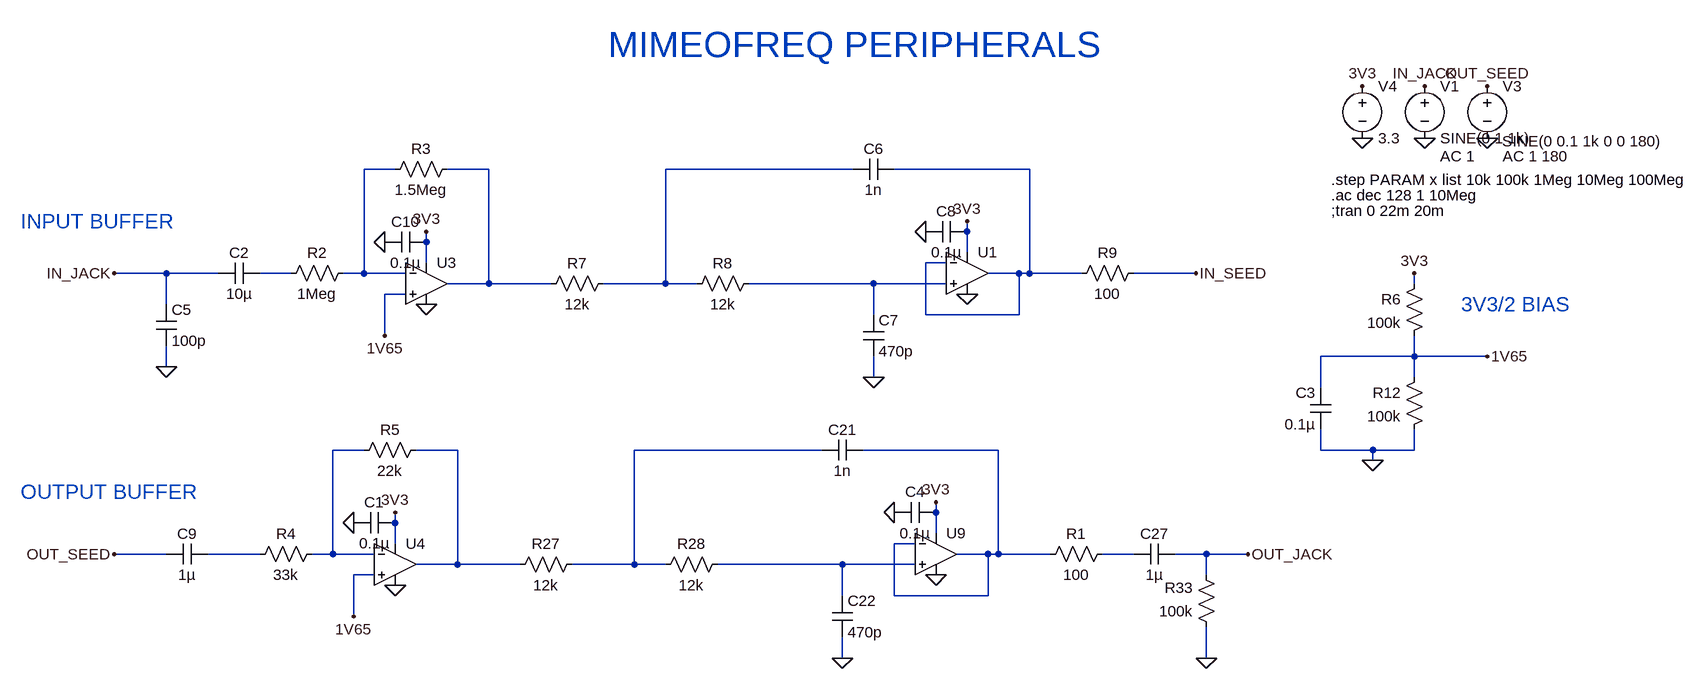
[diagram p0: schematic mimf_peripherals.asc]
mimf_peripherals.asc, the LTspice schematic file:
Version 4
SHEET 1 5352 2584
WIRE 1248 1792 1200 1792
WIRE 1392 1792 1328 1792
WIRE 1952 1792 1664 1792
WIRE 2224 1792 2016 1792
WIRE 2128 1888 2128 1872
WIRE 1296 1904 1296 1888
WIRE 2128 1920 2128 1888
WIRE 1296 1936 1296 1904
WIRE 2096 1936 2064 1936
WIRE 896 1952 816 1952
WIRE 976 1952 896 1952
WIRE 1088 1952 1040 1952
WIRE 1200 1952 1200 1792
WIRE 1200 1952 1168 1952
WIRE 1264 1952 1200 1952
WIRE 2208 1952 2160 1952
WIRE 2224 1952 2224 1792
WIRE 2224 1952 2208 1952
WIRE 2304 1952 2224 1952
WIRE 2480 1952 2384 1952
WIRE 1392 1968 1392 1792
WIRE 1392 1968 1328 1968
WIRE 1488 1968 1392 1968
WIRE 1664 1968 1664 1792
WIRE 1664 1968 1568 1968
WIRE 1712 1968 1664 1968
WIRE 1984 1968 1792 1968
WIRE 2096 1968 1984 1968
WIRE 2816 1968 2816 1952
WIRE 1264 1984 1232 1984
WIRE 896 2000 896 1952
WIRE 1984 2016 1984 1968
WIRE 2064 2016 2064 1936
WIRE 2208 2016 2208 1952
WIRE 2208 2016 2064 2016
WIRE 1232 2048 1232 1984
WIRE 2816 2080 2816 2048
WIRE 2816 2080 2672 2080
WIRE 2928 2080 2816 2080
WIRE 896 2096 896 2064
WIRE 1984 2112 1984 2080
WIRE 2816 2112 2816 2080
WIRE 2672 2128 2672 2080
WIRE 1200 2224 1152 2224
WIRE 1344 2224 1280 2224
WIRE 1904 2224 1616 2224
WIRE 2176 2224 1968 2224
WIRE 2672 2224 2672 2192
WIRE 2752 2224 2672 2224
WIRE 2816 2224 2816 2192
WIRE 2816 2224 2752 2224
WIRE 2752 2240 2752 2224
WIRE 2080 2320 2080 2304
WIRE 1248 2336 1248 2320
WIRE 2080 2352 2080 2320
WIRE 1248 2368 1248 2336
WIRE 2048 2368 2016 2368
WIRE 896 2384 816 2384
WIRE 1040 2384 960 2384
WIRE 1152 2384 1152 2224
WIRE 1152 2384 1120 2384
WIRE 1216 2384 1152 2384
WIRE 2160 2384 2112 2384
WIRE 2176 2384 2176 2224
WIRE 2176 2384 2160 2384
WIRE 2256 2384 2176 2384
WIRE 2384 2384 2336 2384
WIRE 2496 2384 2448 2384
WIRE 2560 2384 2496 2384
WIRE 1344 2400 1344 2224
WIRE 1344 2400 1280 2400
WIRE 1440 2400 1344 2400
WIRE 1616 2400 1616 2224
WIRE 1616 2400 1520 2400
WIRE 1664 2400 1616 2400
WIRE 1936 2400 1744 2400
WIRE 2048 2400 1936 2400
WIRE 1216 2416 1184 2416
WIRE 2496 2416 2496 2384
WIRE 1936 2448 1936 2400
WIRE 2016 2448 2016 2368
WIRE 2160 2448 2160 2384
WIRE 2160 2448 2016 2448
WIRE 1184 2480 1184 2416
WIRE 1936 2544 1936 2512
WIRE 2496 2544 2496 2496
FLAG 2832 1744 0
FLAG 2832 1664 IN_JACK
FLAG 2928 1744 0
FLAG 2928 1664 OUT_SEED
FLAG 1936 2544 0
FLAG 2080 2416 0
FLAG 2496 2544 0
FLAG 2816 1952 3V3
FLAG 2928 2080 1V65
FLAG 2736 1744 0
FLAG 2736 1664 3V3
FLAG 1296 2000 0
FLAG 1296 1888 3V3
FLAG 1232 1904 0
FLAG 2080 2304 3V3
FLAG 2016 2320 0
FLAG 1984 2112 0
FLAG 2128 1984 0
FLAG 2128 1872 3V3
FLAG 2064 1888 0
FLAG 1232 2048 1V65
FLAG 1248 2432 0
FLAG 1248 2320 3V3
FLAG 1184 2336 0
FLAG 1184 2480 1V65
FLAG 2560 2384 OUT_JACK
FLAG 896 2096 0
FLAG 816 2384 OUT_SEED
FLAG 816 1952 IN_JACK
FLAG 2480 1952 IN_SEED
FLAG 2752 2240 0
SYMBOL voltage 2928 1648 R0
WINDOW 123 24 124 Left 2
WINDOW 39 0 0 Left 0
WINDOW 3 23 101 Left 2
SYMATTR Value2 AC 1 180
SYMATTR Value SINE(0 0.1 1k 0 0 180)
SYMATTR InstName V3
SYMBOL res 1536 2384 R90
WINDOW 0 0 56 VBottom 2
WINDOW 3 32 56 VTop 2
SYMATTR InstName R27
SYMATTR Value 12k
SYMBOL res 1760 2384 R90
WINDOW 0 0 56 VBottom 2
WINDOW 3 32 56 VTop 2
SYMATTR InstName R28
SYMATTR Value 12k
SYMBOL cap 1968 2208 R90
WINDOW 0 0 32 VBottom 2
WINDOW 3 32 32 VTop 2
SYMATTR InstName C21
SYMATTR Value 1n
SYMBOL cap 1920 2448 R0
SYMATTR InstName C22
SYMATTR Value 470p
SYMBOL OpAmps\\UniversalOpAmp2 2080 2384 R0
SYMATTR InstName U9
SYMATTR Value2 Avol=1Meg GBW=1Meg Slew=10Meg
SYMBOL res 2512 2512 R180
WINDOW 0 36 76 Left 2
WINDOW 3 36 40 Left 2
SYMATTR InstName R33
SYMATTR Value 100k
SYMBOL cap 2448 2368 R90
WINDOW 0 0 32 VBottom 2
WINDOW 3 32 32 VTop 2
SYMATTR InstName C27
SYMATTR Value 1µ
SYMBOL res 2832 2096 M0
SYMATTR InstName R12
SYMATTR Value 100k
SYMBOL cap 2688 2128 M0
SYMATTR InstName C3
SYMATTR Value 0.1µ
SYMBOL res 2352 2368 R90
WINDOW 0 0 56 VBottom 2
WINDOW 3 32 56 VTop 2
SYMATTR InstName R1
SYMATTR Value 100
SYMBOL voltage 2736 1648 R0
SYMATTR InstName V4
SYMATTR Value 3.3
SYMBOL res 1184 1936 R90
WINDOW 0 0 56 VBottom 2
WINDOW 3 32 56 VTop 2
SYMATTR InstName R2
SYMATTR Value 1Meg
SYMBOL res 1232 1808 R270
WINDOW 0 32 56 VTop 2
WINDOW 3 0 56 VBottom 2
SYMATTR InstName R3
SYMATTR Value 1.5Meg
SYMBOL OpAmps\\UniversalOpAmp2 1296 1968 R0
SYMATTR InstName U3
SYMATTR Value2 Avol=1Meg GBW=1Meg Slew=10Meg
SYMBOL cap 1296 1888 R90
WINDOW 0 0 32 VBottom 2
WINDOW 3 32 32 VTop 2
SYMATTR InstName C10
SYMATTR Value 0.1µ
SYMBOL voltage 2832 1648 R0
WINDOW 123 24 124 Left 2
WINDOW 39 0 0 Left 0
SYMATTR Value2 AC 1
SYMATTR InstName V1
SYMATTR Value SINE(0 1 1k)
SYMBOL cap 2080 2304 R90
WINDOW 0 0 32 VBottom 2
WINDOW 3 32 32 VTop 2
SYMATTR InstName C4
SYMATTR Value 0.1µ
SYMBOL res 2832 1952 M0
SYMATTR InstName R6
SYMATTR Value 100k
SYMBOL res 1584 1952 R90
WINDOW 0 0 56 VBottom 2
WINDOW 3 32 56 VTop 2
SYMATTR InstName R7
SYMATTR Value 12k
SYMBOL res 1808 1952 R90
WINDOW 0 0 56 VBottom 2
WINDOW 3 32 56 VTop 2
SYMATTR InstName R8
SYMATTR Value 12k
SYMBOL cap 2016 1776 R90
WINDOW 0 0 32 VBottom 2
WINDOW 3 32 32 VTop 2
SYMATTR InstName C6
SYMATTR Value 1n
SYMBOL cap 1968 2016 R0
SYMATTR InstName C7
SYMATTR Value 470p
SYMBOL OpAmps\\UniversalOpAmp2 2128 1952 R0
SYMATTR InstName U1
SYMATTR Value2 Avol=1Meg GBW=1Meg Slew=10Meg
SYMBOL res 2400 1936 R90
WINDOW 0 0 56 VBottom 2
WINDOW 3 32 56 VTop 2
SYMATTR InstName R9
SYMATTR Value 100
SYMBOL cap 2128 1872 R90
WINDOW 0 0 32 VBottom 2
WINDOW 3 32 32 VTop 2
SYMATTR InstName C8
SYMATTR Value 0.1µ
SYMBOL cap 1040 1936 R90
WINDOW 0 0 32 VBottom 2
WINDOW 3 32 32 VTop 2
SYMATTR InstName C2
SYMATTR Value 10µ
SYMBOL res 1136 2368 R90
WINDOW 0 0 56 VBottom 2
WINDOW 3 32 56 VTop 2
SYMATTR InstName R4
SYMATTR Value 33k
SYMBOL res 1184 2240 R270
WINDOW 0 32 56 VTop 2
WINDOW 3 0 56 VBottom 2
SYMATTR InstName R5
SYMATTR Value 22k
SYMBOL OpAmps\\UniversalOpAmp2 1248 2400 R0
SYMATTR InstName U4
SYMATTR Value2 Avol=1Meg GBW=1Meg Slew=10Meg
SYMBOL cap 1248 2320 R90
WINDOW 0 0 32 VBottom 2
WINDOW 3 32 32 VTop 2
SYMATTR InstName C1
SYMATTR Value 0.1µ
SYMBOL cap 960 2368 R90
WINDOW 0 0 32 VBottom 2
WINDOW 3 32 32 VTop 2
SYMATTR InstName C9
SYMATTR Value 1µ
SYMBOL cap 880 2000 R0
SYMATTR InstName C5
SYMATTR Value 100p
TEXT 2688 1856 Left 2 !;tran 0 22m 20m
TEXT 2688 1832 Left 2 !.ac dec 128 1 10Meg
TEXT 2688 1808 Left 2 !.step PARAM x list 10k 100k 1Meg 10Meg 100Meg
TEXT 672 1872 Left 3 ;INPUT BUFFER
TEXT 672 2288 Left 3 ;OUTPUT BUFFER
TEXT 2888 2000 Left 3 ;3V3/2 BIAS
TEXT 1576 1600 Left 5 ;MIMEOFREQ PERIPHERALS

The netlist it stands for:
* mimf_peripherals.asc
V3 OUT_SEED 0 SINE(0 0.1 1k 0 0 180) AC 1 180
R27 N009 N008 12k
R28 N013 N009 12k
C21 N010 N009 1n
C22 N013 0 470p
XU9 N013 N010 3V3 0 N010 level2 Avol=1Meg GBW=1Meg Slew=10Meg Ilimit=25m Rail=0 Vos=0 En=0 Enk=0 In=0 Ink=0 Rin=500Meg  ; pins In+ In- V+ V- OUT
R33 0 OUT_JACK 100k
C27 OUT_JACK N012 1µ
R12 1V65 0 100k
C3 1V65 0 0.1µ
R1 N012 N010 100
V4 3V3 0 3.3
R2 N001 N005 1Meg
R3 N001 N002 1.5Meg
XU3 1V65 N001 3V3 0 N002 level2 Avol=1Meg GBW=1Meg Slew=10Meg Ilimit=25m Rail=0 Vos=0 En=0 Enk=0 In=0 Ink=0 Rin=500Meg  ; pins In+ In- V+ V- OUT
C10 3V3 0 0.1µ
V1 IN_JACK 0 SINE(0 1 1k) AC 1
C4 3V3 0 0.1µ
R6 3V3 1V65 100k
R7 N003 N002 12k
R8 N006 N003 12k
C6 N004 N003 1n
C7 N006 0 470p
XU1 N006 N004 3V3 0 N004 level2 Avol=1Meg GBW=1Meg Slew=10Meg Ilimit=25m Rail=0 Vos=0 En=0 Enk=0 In=0 Ink=0 Rin=500Meg  ; pins In+ In- V+ V- OUT
R9 IN_SEED N004 100
C8 3V3 0 0.1µ
C2 N005 IN_JACK 10µ
R4 N007 N011 33k
R5 N007 N008 22k
XU4 1V65 N007 3V3 0 N008 level2 Avol=1Meg GBW=1Meg Slew=10Meg Ilimit=25m Rail=0 Vos=0 En=0 Enk=0 In=0 Ink=0 Rin=500Meg  ; pins In+ In- V+ V- OUT
C1 3V3 0 0.1µ
C9 N011 OUT_SEED 1µ
C5 IN_JACK 0 100p
;tran 0 22m 20m
.ac dec 128 1 10Meg
.step PARAM x list 10k 100k 1Meg 10Meg 100Meg
* INPUT BUFFER
* OUTPUT BUFFER
* 3V3/2 BIAS
* MIMEOFREQ PERIPHERALS
.lib UniversalOpAmp2.lib
.backanno
.end